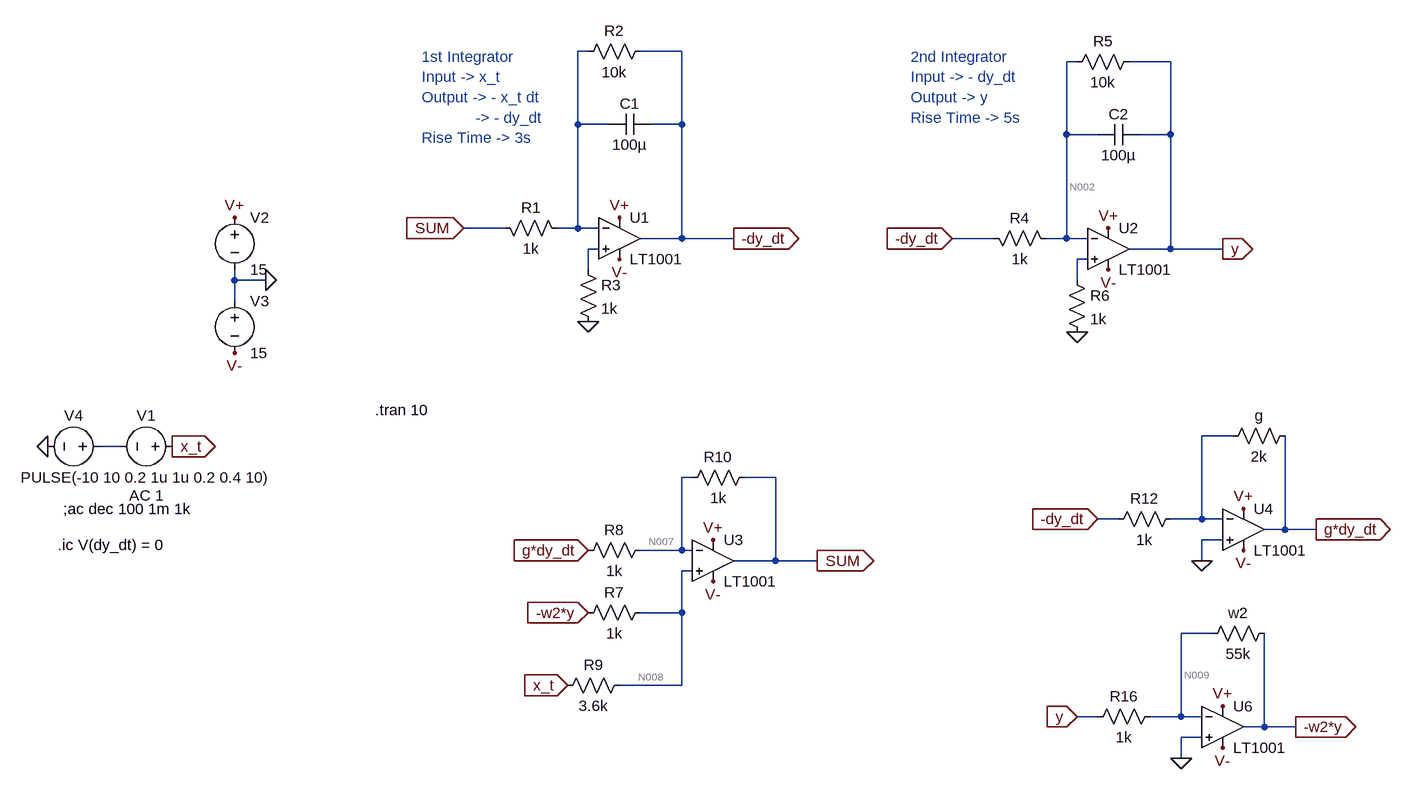
[diagram p0: schematic Analogue_Computer_4.asc]
Analogue_Computer_4.asc, the LTspice schematic file:
Version 4
SHEET 1 1812 1080
WIRE 32 -352 16 -352
WIRE 176 -352 112 -352
WIRE 784 -336 768 -336
WIRE 928 -336 864 -336
WIRE 16 -240 16 -352
WIRE 64 -240 16 -240
WIRE 176 -240 176 -352
WIRE 176 -240 128 -240
WIRE 768 -224 768 -336
WIRE 816 -224 768 -224
WIRE 928 -224 928 -336
WIRE 928 -224 880 -224
WIRE -96 -80 -160 -80
WIRE 16 -80 16 -240
WIRE 16 -80 -16 -80
WIRE 48 -80 16 -80
WIRE 176 -64 176 -240
WIRE 176 -64 112 -64
WIRE 256 -64 176 -64
WIRE 656 -64 592 -64
WIRE 768 -64 768 -224
WIRE 768 -64 736 -64
WIRE 800 -64 768 -64
WIRE 48 -48 32 -48
WIRE 928 -48 928 -224
WIRE 928 -48 864 -48
WIRE 1008 -48 928 -48
WIRE 800 -32 784 -32
WIRE 32 -16 32 -48
WIRE -512 0 -512 -16
WIRE -464 0 -512 0
WIRE 784 0 784 -32
WIRE -512 32 -512 0
WIRE 1024 240 976 240
WIRE -688 256 -720 256
WIRE 192 304 176 304
WIRE 320 304 272 304
WIRE 848 368 816 368
WIRE 976 368 976 240
WIRE 976 368 928 368
WIRE 1008 368 976 368
WIRE 1104 384 1104 240
WIRE 1104 384 1072 384
WIRE 1152 384 1104 384
WIRE 1008 400 976 400
WIRE 176 416 176 304
WIRE 176 416 112 416
WIRE 192 416 176 416
WIRE 320 432 320 304
WIRE 320 432 256 432
WIRE 384 432 320 432
WIRE 976 432 976 400
WIRE 192 448 176 448
WIRE 176 512 176 448
WIRE 176 512 112 512
WIRE 992 544 944 544
WIRE 176 624 176 512
WIRE 176 624 80 624
WIRE 816 672 784 672
WIRE 944 672 944 544
WIRE 944 672 896 672
WIRE 976 672 944 672
WIRE 1072 688 1072 544
WIRE 1072 688 1040 688
WIRE 1120 688 1072 688
WIRE 976 704 944 704
WIRE 944 736 944 704
FLAG -464 0 0
FLAG -512 -96 V+
FLAG -512 112 V-
FLAG 80 -96 V+
FLAG 80 -32 V-
FLAG 256 -64 -dy_dt
IOPIN 256 -64 Out
FLAG 32 64 0
FLAG -608 256 x_t
IOPIN -608 256 Out
FLAG 832 -80 V+
FLAG 832 -16 V-
FLAG 1008 -48 y
IOPIN 1008 -48 Out
FLAG 784 80 0
FLAG 592 -64 -dy_dt
IOPIN 592 -64 In
FLAG 224 400 V+
FLAG 224 464 V-
FLAG 384 432 SUM
IOPIN 384 432 Out
FLAG -160 -80 SUM
IOPIN -160 -80 In
FLAG 976 432 0
FLAG 816 368 -dy_dt
IOPIN 816 368 In
FLAG 1152 384 g*dy_dt
IOPIN 1152 384 Out
FLAG 944 736 0
FLAG 784 672 y
IOPIN 784 672 In
FLAG 1120 688 -w2*y
IOPIN 1120 688 Out
FLAG 0 624 x_t
IOPIN 0 624 In
FLAG 32 512 -w2*y
IOPIN 32 512 In
FLAG 32 416 g*dy_dt
IOPIN 32 416 In
FLAG 1008 656 V+
FLAG 1040 352 V+
FLAG 1008 720 V-
FLAG 1040 416 V-
FLAG -800 256 0
SYMBOL OpAmps\\LT1001 80 -128 R0
SYMATTR InstName U1
SYMBOL res -112 -96 M90
WINDOW 0 0 56 VBottom 2
WINDOW 3 32 56 VTop 2
SYMATTR InstName R1
SYMATTR Value 1k
SYMBOL voltage -592 256 R90
WINDOW 0 -32 56 VBottom 2
WINDOW 3 32 56 VTop 2
WINDOW 123 60 56 VTop 2
WINDOW 39 0 0 Left 0
SYMATTR InstName V1
SYMATTR Value PULSE(-10 10 0.2 1u 1u 0.2 0.4 10)
SYMATTR Value2 AC 1
SYMBOL voltage -512 -112 R0
WINDOW 123 0 0 Left 0
WINDOW 39 0 0 Left 0
SYMATTR InstName V2
SYMATTR Value 15
SYMBOL voltage -512 16 R0
WINDOW 123 0 0 Left 0
WINDOW 39 0 0 Left 0
SYMATTR InstName V3
SYMATTR Value 15
SYMBOL cap 128 -256 R90
WINDOW 0 0 32 VBottom 2
WINDOW 3 32 32 VTop 2
SYMATTR InstName C1
SYMATTR Value 100µ
SYMBOL res 128 -368 R90
WINDOW 0 0 56 VBottom 2
WINDOW 3 32 56 VTop 2
SYMATTR InstName R2
SYMATTR Value 10k
SYMBOL res 16 -32 R0
SYMATTR InstName R3
SYMATTR Value 1k
SYMBOL OpAmps\\LT1001 832 -112 R0
SYMATTR InstName U2
SYMBOL res 640 -80 M90
WINDOW 0 0 56 VBottom 2
WINDOW 3 32 56 VTop 2
SYMATTR InstName R4
SYMATTR Value 1k
SYMBOL cap 880 -240 R90
WINDOW 0 0 32 VBottom 2
WINDOW 3 32 32 VTop 2
SYMATTR InstName C2
SYMATTR Value 100µ
SYMBOL res 880 -352 R90
WINDOW 0 0 56 VBottom 2
WINDOW 3 32 56 VTop 2
SYMATTR InstName R5
SYMATTR Value 10k
SYMBOL res 768 -16 R0
SYMATTR InstName R6
SYMATTR Value 1k
SYMBOL OpAmps\\LT1001 224 368 R0
SYMATTR InstName U3
SYMBOL res 128 496 R90
WINDOW 0 0 56 VBottom 2
WINDOW 3 32 56 VTop 2
SYMATTR InstName R7
SYMATTR Value 1k
SYMBOL res 128 400 R90
WINDOW 0 0 56 VBottom 2
WINDOW 3 32 56 VTop 2
SYMATTR InstName R8
SYMATTR Value 1k
SYMBOL res 96 608 R90
WINDOW 0 0 56 VBottom 2
WINDOW 3 32 56 VTop 2
SYMATTR InstName R9
SYMATTR Value 3.6k
SYMBOL res 288 288 R90
WINDOW 0 0 56 VBottom 2
WINDOW 3 32 56 VTop 2
SYMATTR InstName R10
SYMATTR Value 1k
SYMBOL OpAmps\\LT1001 1040 320 R0
SYMATTR InstName U4
SYMBOL res 1120 224 R90
WINDOW 0 0 56 VBottom 2
WINDOW 3 32 56 VTop 2
SYMATTR InstName g
SYMATTR Value 2k
SYMBOL res 944 352 R90
WINDOW 0 0 56 VBottom 2
WINDOW 3 32 56 VTop 2
SYMATTR InstName R12
SYMATTR Value 1k
SYMBOL OpAmps\\LT1001 1008 624 R0
SYMATTR InstName U6
SYMBOL res 1088 528 R90
WINDOW 0 0 56 VBottom 2
WINDOW 3 32 56 VTop 2
SYMATTR InstName w2
SYMATTR Value 55k
SYMBOL res 912 656 R90
WINDOW 0 0 56 VBottom 2
WINDOW 3 32 56 VTop 2
SYMATTR InstName R16
SYMATTR Value 1k
SYMBOL voltage -704 256 R90
WINDOW 0 -32 56 VBottom 2
WINDOW 3 -4 56 VBottom 2
WINDOW 123 0 0 Left 0
WINDOW 39 0 0 Left 0
SYMATTR InstName V4
SYMATTR Value ""
TEXT -776 352 Left 2 !;ac dec 100 1m 1k
TEXT -784 408 Left 2 !.ic V(dy_dt) = 0
TEXT -224 -344 Left 2 ;1st Integrator\nInput -> x_t\nOutput -> - x_t dt\n            -> - dy_dt\nRise Time -> 3s
TEXT 528 -344 Left 2 ;2nd Integrator\nInput -> - dy_dt\nOutput -> y\nRise Time -> 5s
TEXT -296 200 Left 2 !.tran 10

The netlist it stands for:
* Analogue_Computer_4.asc
XU1 N003 N001 V+ V- -dy_dt LT1001  ; pins In+ In- V+ V- OUT
R1 SUM N001 1k
V1 x_t N006 PULSE(-10 10 0.2 1u 1u 0.2 0.4 10) AC 1
V2 V+ 0 15
V3 0 V- 15
C1 -dy_dt N001 100µ
R2 -dy_dt N001 10k
R3 N003 0 1k
XU2 N004 N002 V+ V- y LT1001  ; pins In+ In- V+ V- OUT
R4 -dy_dt N002 1k
C2 y N002 100µ
R5 y N002 10k
R6 N004 0 1k
XU3 N008 N007 V+ V- SUM LT1001  ; pins In+ In- V+ V- OUT
R7 N008 -w2*y 1k
R8 N007 g*dy_dt 1k
R9 N008 x_t 3.6k
R10 SUM N007 1k
XU4 0 N005 V+ V- g*dy_dt LT1001  ; pins In+ In- V+ V- OUT
R§g g*dy_dt N005 2k
R12 N005 -dy_dt 1k
XU6 0 N009 V+ V- -w2*y LT1001  ; pins In+ In- V+ V- OUT
R§w2 -w2*y N009 55k
R16 N009 y 1k
V4 N006 0
;ac dec 100 1m 1k
.ic V(dy_dt) = 0
* 1st Integrator
* Input -> x_t
* Output -> - x_t dt
*             -> - dy_dt
* Rise Time -> 3s
* 2nd Integrator
* Input -> - dy_dt
* Output -> y
* Rise Time -> 5s
.tran 10
.lib LTC.lib
.backanno
.end

* Results of the author's LTspice run, read from the files saved beside the schematic
* Operating Point, zero values left out:
*   V(v+) = 15 V
*   V(v-) = -15 V
*   V(-dy_dt) = 5.039 mV
*   V(sum) = -503.9 µV
*   V(x_t) = -10 V
*   V(n002) = 70 nV
*   V(y) = -50.39 mV
*   V(n007) = -5.291 mV
*   V(n008) = -5.291 mV
*   V(-w2*y) = 2.771 V
*   V(g*dy_dt) = -10.08 mV
*   V(n009) = -3.84 µV
*   I(R16) = 50.38 µA
*   I(W2) = 50.38 µA
*   I(R12) = -5.039 µA
*   I(G) = -5.039 µA
*   I(R10) = 4.787 µA
*   I(R9) = 2.776 mA
*   I(R8) = 4.787 µA
*   I(R7) = -2.776 mA
*   I(R5) = -5.039 µA
*   I(R4) = 5.039 µA
*   I(R2) = 503.9 nA
*   I(R1) = -503.9 nA
*   I(V4) = 2.776 mA
*   I(V3) = -10.08 mA
*   I(V2) = -12.86 mA
*   I(V1) = 2.776 mA
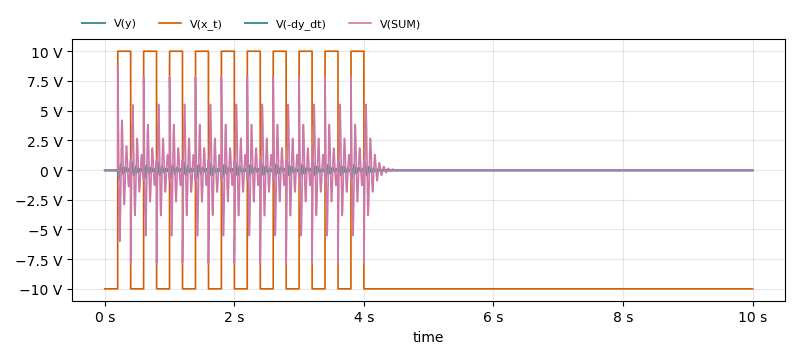
[diagram p1: Transient Analysis of Analogue_Computer_4.asc, plotted from the saved traces]
* Transient Analysis, 1 run:
*   V(y): min -113.1 mV, max 118.9 mV, average -30.23 mV, rms 53.95 mV, last -50.39 mV
*   V(x_t): min -10 V, max 10 V, average -6 V, rms 10 V, last -10 V
*   V(-dy_dt): min -775.6 mV, max 708.1 mV, average 3.017 mV, rms 178.7 mV, last 5.039 mV
*   V(SUM): min -7.843 V, max 8.705 V, average -231.8 µV, rms 1.667 V, last -503.9 µV